# Altium schematic sheet SuperFin Baseboard pg10.SchDoc
size D; PageSetup: Record=PageOptions|CenterHorizontal=True|CenterVertical=True|PrintScale=1.06|XCorrection=1.00|YCorrection=1.00|PrintKind=0|BorderSize=5000000|LeftOffset=0|BottomOffset=0|Orientation=2|PaperLength=1000|PaperWidth=1000|Scale=100|PaperSource=15|PrintQuality=600|MediaType=1|DitherType=10|PaperKind=C|PrintScaleMode=1
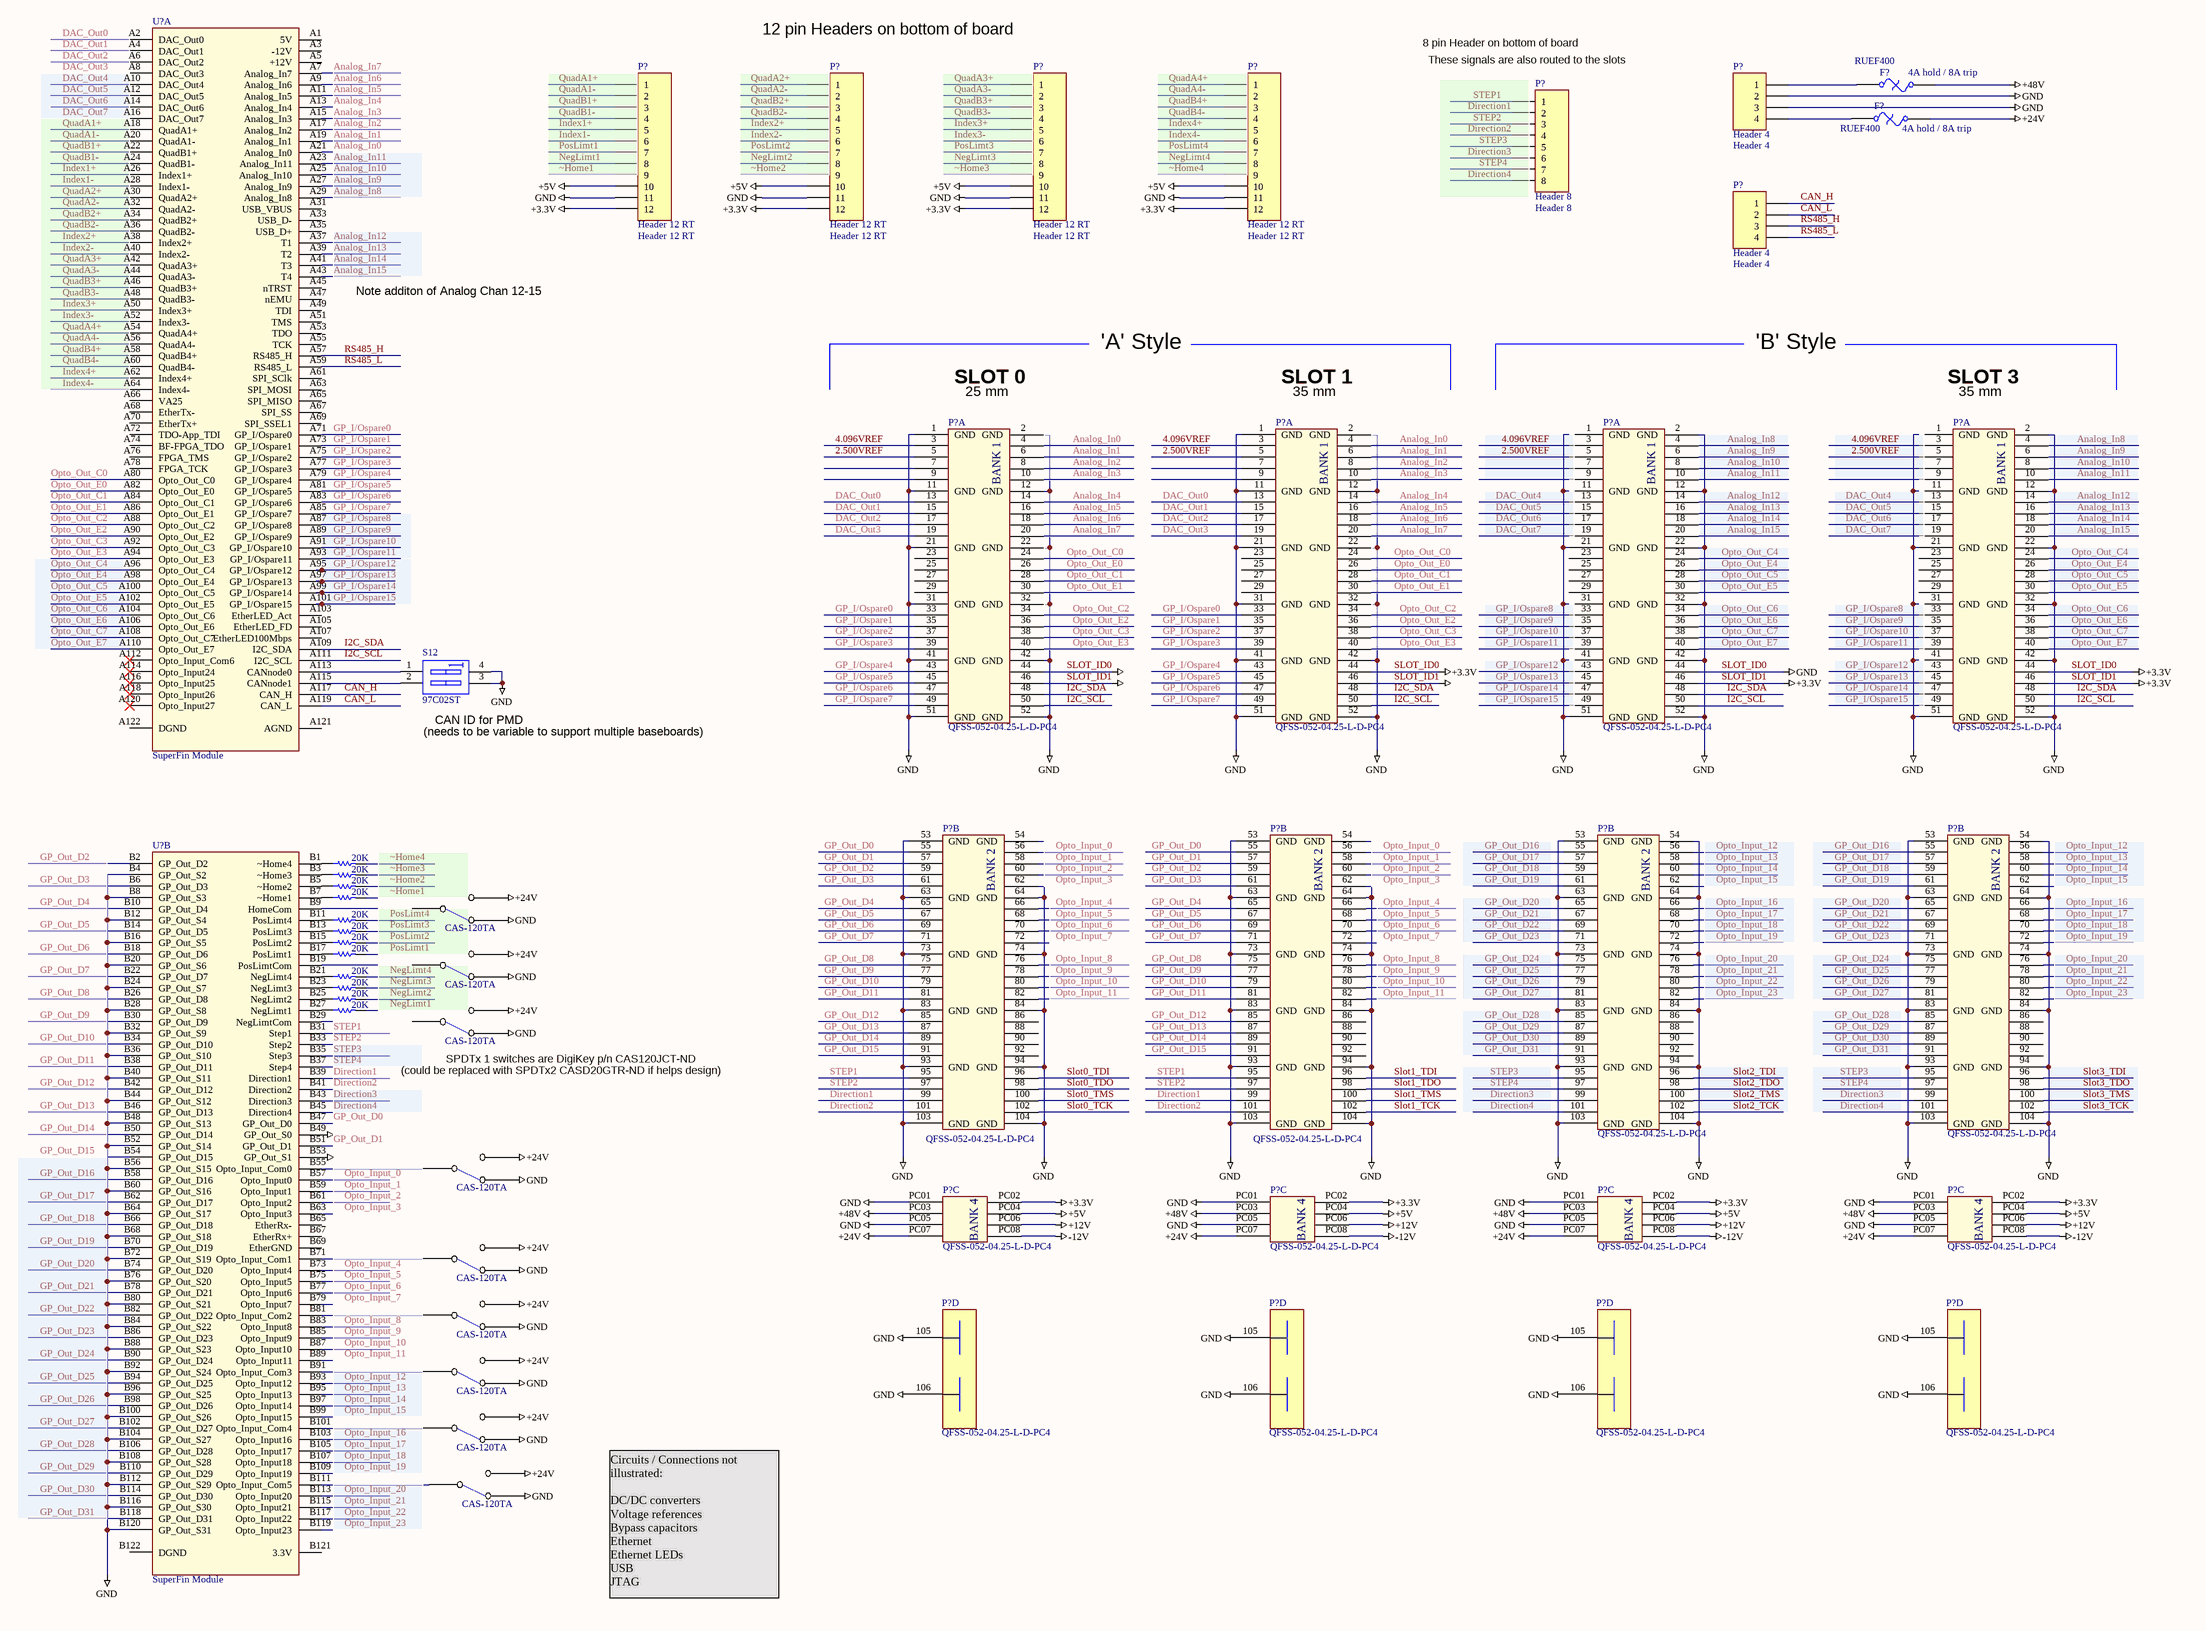
[diagram p0: SuperFin Baseboard pg10.SchDoc]

## Parts
(Parts that share a designator on the sheet are numbered #1, #2 ... from top to bottom, then left to right.)
F?#1  4A hold / 8A trip  value RUEF400  [PolySwitch Radial 0.2]
F?#2  4A hold / 8A trip  value RUEF400  [PolySwitch Radial 0.2]
P?#1  Header 12 RT  [HDR 1x12 RT for IDC]
P?#2  Header 12 RT  [HDR 1x12 RT for IDC]
P?#3  Header 12 RT  [HDR 1x12 RT for IDC]
P?#4  Header 12 RT  [HDR 1x12 RT for IDC]
P?#5  Header 4  [HDR1X4 for IDC]
P?#6  Header 8  [HDR1X8 for IDC]
P?#7  Header 4  [HDR1X4 for IDC]
P?#8  value QFSS-052-04.25-L-D-PC4  [QFS SMD PWR PINS - 104 pins]  (hidden comment: QFSS-PC4-104pin)  (part A of 4)
P?#9  value QFSS-052-04.25-L-D-PC4  [QFS SMD PWR PINS - 104 pins]  (hidden comment: QFSS-PC4-104pin)  (part A of 4)
P?#10  value QFSS-052-04.25-L-D-PC4  [QFS SMD PWR PINS - 104 pins]  (hidden comment: QFSS-PC4-104pin)  (part A of 4)
P?#11  value QFSS-052-04.25-L-D-PC4  [QFS SMD PWR PINS - 104 pins]  (hidden comment: QFSS-PC4-104pin)  (part A of 4)
P?#12  value QFSS-052-04.25-L-D-PC4  [QFS SMD PWR PINS - 104 pins]  (hidden comment: QFSS-PC4-104pin)  (part B of 4)
P?#13  value QFSS-052-04.25-L-D-PC4  [QFS SMD PWR PINS - 104 pins]  (hidden comment: QFSS-PC4-104pin)  (part B of 4)
P?#14  value QFSS-052-04.25-L-D-PC4  [QFS SMD PWR PINS - 104 pins]  (hidden comment: QFSS-PC4-104pin)  (part B of 4)
P?#15  value QFSS-052-04.25-L-D-PC4  [QFS SMD PWR PINS - 104 pins]  (hidden comment: QFSS-PC4-104pin)  (part B of 4)
P?#16  value QFSS-052-04.25-L-D-PC4  [QFS SMD PWR PINS - 104 pins]  (hidden comment: QFSS-PC4-104pin)  (part C of 4)
P?#17  value QFSS-052-04.25-L-D-PC4  [QFS SMD PWR PINS - 104 pins]  (hidden comment: QFSS-PC4-104pin)  (part C of 4)
P?#18  value QFSS-052-04.25-L-D-PC4  [QFS SMD PWR PINS - 104 pins]  (hidden comment: QFSS-PC4-104pin)  (part C of 4)
P?#19  value QFSS-052-04.25-L-D-PC4  [QFS SMD PWR PINS - 104 pins]  (hidden comment: QFSS-PC4-104pin)  (part C of 4)
P?#20  value QFSS-052-04.25-L-D-PC4  [QFS SMD PWR PINS - 104 pins]  (hidden comment: QFSS-PC4-104pin)  (part D of 4)
P?#21  value QFSS-052-04.25-L-D-PC4  [QFS SMD PWR PINS - 104 pins]  (hidden comment: QFSS-PC4-104pin)  (part D of 4)
P?#22  value QFSS-052-04.25-L-D-PC4  [QFS SMD PWR PINS - 104 pins]  (hidden comment: QFSS-PC4-104pin)  (part D of 4)
P?#23  value QFSS-052-04.25-L-D-PC4  [QFS SMD PWR PINS - 104 pins]  (hidden comment: QFSS-PC4-104pin)  (part D of 4)
R?#1  value 20K  [AXIAL-0.4]  (hidden comment: Res TH)
R?#2  value 20K  [AXIAL-0.4]  (hidden comment: Res TH)
R?#3  value 20K  [AXIAL-0.4]  (hidden comment: Res TH)
R?#4  value 20K  [AXIAL-0.4]  (hidden comment: Res TH)
R?#5  value 20K  [AXIAL-0.4]  (hidden comment: Res TH)
R?#6  value 20K  [AXIAL-0.4]  (hidden comment: Res TH)
R?#7  value 20K  [AXIAL-0.4]  (hidden comment: Res TH)
R?#8  value 20K  [AXIAL-0.4]  (hidden comment: Res TH)
R?#9  value 20K  [AXIAL-0.4]  (hidden comment: Res TH)
R?#10  value 20K  [AXIAL-0.4]  (hidden comment: Res TH)
R?#11  value 20K  [AXIAL-0.4]  (hidden comment: Res TH)
R?#12  value 20K  [AXIAL-0.4]  (hidden comment: Res TH)
S12  97C02ST  [97C02ST]
S?#1  CAS-120TA  [CAS-120B]
S?#2  CAS-120TA  [CAS-120B]
S?#3  CAS-120TA  [CAS-120B]
S?#4  CAS-120TA  [CAS-120B]
S?#5  CAS-120TA  [CAS-120B]
S?#6  CAS-120TA  [CAS-120B]
S?#7  CAS-120TA  [CAS-120B]
S?#8  CAS-120TA  [CAS-120B]
S?#9  CAS-120TA  [CAS-120B]
U?#1  SuperFin Module  [SuperFin Footprint]  (part A of 2)
U?#2  SuperFin Module  [SuperFin Footprint]  (part B of 2)

## Nets
+5V: P?#1.10 P?#2.10 P?#3.10 P?#4.10 P?#16.PC04 P?#17.PC04 P?#18.PC04 P?#19.PC04
+12V: P?#16.PC06 P?#17.PC06 P?#18.PC06 P?#19.PC06
+24V: F?#2.2 P?#16.PC07 P?#17.PC07 P?#18.PC07 P?#19.PC07 S?#1.1(NO) S?#2.1(NO) S?#3.1(NO) S?#4.1(NO) S?#5.1(NO) S?#6.1(NO) S?#7.1(NO) S?#8.1(NO) S?#9.1(NO)
+48V: F?#1.2 P?#16.PC03 P?#17.PC03 P?#18.PC03 P?#19.PC03
-12V: P?#16.PC08 P?#17.PC08 P?#18.PC08 P?#19.PC08
SLOT_ID0: P?#1.11 P?#1.12 P?#2.11 P?#2.12 P?#3.11 P?#3.12 P?#4.11 P?#4.12 P?#5.2 P?#5.3 P?#8.1(GND) P?#8.2(GND) P?#8.11(GND) P?#8.12(GND) P?#8.21(GND) P?#8.22(GND) P?#8.31(GND) P?#8.32(GND) P?#8.41(GND) P?#8.42(GND) P?#8.44 P?#8.46 P?#8.51(GND) P?#8.52(GND) P?#9.1(GND) P?#9.2(GND) P?#9.11(GND) P?#9.12(GND) P?#9.21(GND) P?#9.22(GND) P?#9.31(GND) P?#9.32(GND) P?#9.41(GND) P?#9.42(GND) P?#9.44 P?#9.46 P?#9.51(GND) P?#9.52(GND) P?#10.1(GND) P?#10.2(GND) P?#10.11(GND) P?#10.12(GND) P?#10.21(GND) P?#10.22(GND) P?#10.31(GND) P?#10.32(GND) P?#10.41(GND) P?#10.42(GND) P?#10.44 P?#10.46 P?#10.51(GND) P?#10.52(GND) P?#11.1(GND) P?#11.2(GND) P?#11.11(GND) P?#11.12(GND) P?#11.21(GND) P?#11.22(GND) P?#11.31(GND) P?#11.32(GND) P?#11.41(GND) P?#11.42(GND) P?#11.44 P?#11.46 P?#11.51(GND) P?#11.52(GND) P?#12.53(GND) P?#12.54(GND) P?#12.63(GND) P?#12.64(GND) P?#12.73(GND) P?#12.74(GND) P?#12.83(GND) P?#12.84(GND) P?#12.93(GND) P?#12.94(GND) P?#12.103(GND) P?#12.104(GND) P?#13.53(GND) P?#13.54(GND) P?#13.63(GND) P?#13.64(GND) P?#13.73(GND) P?#13.74(GND) P?#13.83(GND) P?#13.84(GND) P?#13.93(GND) P?#13.94(GND) P?#13.103(GND) P?#13.104(GND) P?#14.53(GND) P?#14.54(GND) P?#14.63(GND) P?#14.64(GND) P?#14.73(GND) P?#14.74(GND) P?#14.83(GND) P?#14.84(GND) P?#14.93(GND) P?#14.94(GND) P?#14.103(GND) P?#14.104(GND) P?#15.53(GND) P?#15.54(GND) P?#15.63(GND) P?#15.64(GND) P?#15.73(GND) P?#15.74(GND) P?#15.83(GND) P?#15.84(GND) P?#15.93(GND) P?#15.94(GND) P?#15.103(GND) P?#15.104(GND) P?#16.PC01 P?#16.PC02 P?#16.PC05 P?#17.PC01 P?#17.PC02 P?#17.PC05 P?#18.PC01 P?#18.PC02 P?#18.PC05 P?#19.PC01 P?#19.PC02 P?#19.PC05 P?#20.105(GND) P?#20.106(GND) P?#21.105(GND) P?#21.106(GND) P?#22.105(GND) P?#22.106(GND) P?#23.105(GND) P?#23.106(GND) S12.3(B2) S12.4(B1) S?#1.3(NC) S?#2.3(NC) S?#3.3(NC) S?#4.3(NC) S?#5.3(NC) S?#6.3(NC) S?#7.3(NC) S?#8.3(NC) S?#9.3(NC) U?#2.B4(GP_Out_S2) U?#2.B8(GP_Out_S3) U?#2.B12(GP_Out_S4) U?#2.B16(GP_Out_S5) U?#2.B20(GP_Out_S6) U?#2.B24(GP_Out_S7) U?#2.B28(GP_Out_S8) U?#2.B32(GP_Out_S9) U?#2.B36(GP_Out_S10) U?#2.B40(GP_Out_S11) U?#2.B44(GP_Out_S12) U?#2.B48(GP_Out_S13) U?#2.B49(GP_Out_S0) U?#2.B52(GP_Out_S14) U?#2.B53(GP_Out_S1) U?#2.B56(GP_Out_S15) U?#2.B60(GP_Out_S16) U?#2.B64(GP_Out_S17) U?#2.B68(GP_Out_S18) U?#2.B72(GP_Out_S19) U?#2.B76(GP_Out_S20) U?#2.B80(GP_Out_S21) U?#2.B84(GP_Out_S22) U?#2.B88(GP_Out_S23) U?#2.B92(GP_Out_S24) U?#2.B96(GP_Out_S25) U?#2.B100(GP_Out_S26) U?#2.B104(GP_Out_S27) U?#2.B108(GP_Out_S28) U?#2.B112(GP_Out_S29) U?#2.B116(GP_Out_S30) U?#2.B120(GP_Out_S31)  [also labelled +3.3V, GND, SLOT_ID1]
2.500VREF: P?#8.5 P?#9.5 P?#10.5 P?#11.5
4.096VREF: P?#8.3 P?#9.3 P?#10.3 P?#11.3
Analog_In0: P?#8.4 P?#9.4 U?#1.A21(Analog_In0)
Analog_In1: P?#8.6 P?#9.6 U?#1.A19(Analog_In1)
Analog_In2: P?#8.8 P?#9.8 U?#1.A17(Analog_In2)
Analog_In3: P?#8.10 P?#9.10 U?#1.A15(Analog_In3)
Analog_In4: P?#8.14 P?#9.14 U?#1.A13(Analog_In4)
Analog_In5: P?#8.16 P?#9.16 U?#1.A11(Analog_In5)
Analog_In6: P?#8.18 P?#9.18 U?#1.A9(Analog_In6)
Analog_In7: P?#8.20 P?#9.20 U?#1.A7(Analog_In7)
Analog_In8: P?#10.4 P?#11.4 U?#1.A29(Analog_In8)
Analog_In9: P?#10.6 P?#11.6 U?#1.A27(Analog_In9)
Analog_In10: P?#10.8 P?#11.8 U?#1.A25(Analog_In10)
Analog_In11: P?#10.10 P?#11.10 U?#1.A23(Analog_In11)
Analog_In12: P?#10.14 P?#11.14 U?#1.A37(T1)
Analog_In13: P?#10.16 P?#11.16 U?#1.A39(T2)
Analog_In14: P?#10.18 P?#11.18 U?#1.A41(T3)
Analog_In15: P?#10.20 P?#11.20 U?#1.A43(T4)
CAN_H: P?#7.1 U?#1.A117(CAN_H)
CAN_L: P?#7.2 U?#1.A119(CAN_L)
DAC_Out0: P?#8.13 P?#9.13 U?#1.A2(DAC_Out0)
DAC_Out1: P?#8.15 P?#9.15 U?#1.A4(DAC_Out1)
DAC_Out2: P?#8.17 P?#9.17 U?#1.A6(DAC_Out2)
DAC_Out3: P?#8.19 P?#9.19 U?#1.A8(DAC_Out3)
DAC_Out4: P?#10.13 P?#11.13 U?#1.A10(DAC_Out4)
DAC_Out5: P?#10.15 P?#11.15 U?#1.A12(DAC_Out5)
DAC_Out6: P?#10.17 P?#11.17 U?#1.A14(DAC_Out6)
DAC_Out7: P?#10.19 P?#11.19 U?#1.A16(DAC_Out7)
Direction1: P?#6.2 P?#12.99 P?#13.99 U?#2.B39(Direction1)
Direction2: P?#6.4 P?#12.101 P?#13.101 U?#2.B41(Direction2)
Direction3: P?#6.6 P?#14.99 P?#15.99 U?#2.B43(Direction3)
Direction4: P?#6.8 P?#14.101 P?#15.101 U?#2.B45(Direction4)
GP_I/Ospare0: P?#8.33 P?#9.33 U?#1.A71(GP_I/Ospare0)
GP_I/Ospare1: P?#8.35 P?#9.35 U?#1.A73(GP_I/Ospare1)
GP_I/Ospare2: P?#8.37 P?#9.37 U?#1.A75(GP_I/Ospare2)
GP_I/Ospare3: P?#8.39 P?#9.39 U?#1.A77(GP_I/Ospare3)
GP_I/Ospare4: P?#8.43 P?#9.43 U?#1.A79(GP_I/Ospare4)
GP_I/Ospare5: P?#8.45 P?#9.45 U?#1.A81(GP_I/Ospare5)
GP_I/Ospare6: P?#8.47 P?#9.47 U?#1.A83(GP_I/Ospare6)
GP_I/Ospare7: P?#8.49 P?#9.49 U?#1.A85(GP_I/Ospare7)
GP_I/Ospare8: P?#10.33 P?#11.33 U?#1.A87(GP_I/Ospare8)
GP_I/Ospare9: P?#10.35 P?#11.35 U?#1.A89(GP_I/Ospare9)
GP_I/Ospare10: P?#10.37 P?#11.37 U?#1.A91(GP_I/Ospare10)
GP_I/Ospare11: P?#10.39 P?#11.39 U?#1.A93(GP_I/Ospare11)
GP_I/Ospare12: P?#10.43 P?#11.43 U?#1.A95(GP_I/Ospare12)
GP_I/Ospare13: P?#10.45 P?#11.45 U?#1.A97(GP_I/Ospare13)
GP_I/Ospare14: P?#10.47 P?#11.47 U?#1.A99(GP_I/Ospare14)
GP_I/Ospare15: P?#10.49 P?#11.49 U?#1.A101(GP_I/Ospare15)
GP_Out_D0: P?#12.55 P?#13.55 U?#2.B47(GP_Out_D0)
GP_Out_D1: P?#12.57 P?#13.57 U?#2.B51(GP_Out_D1)
GP_Out_D2: P?#12.59 P?#13.59 U?#2.B2(GP_Out_D2)
GP_Out_D3: P?#12.61 P?#13.61 U?#2.B6(GP_Out_D3)
GP_Out_D4: P?#12.65 P?#13.65 U?#2.B10(GP_Out_D4)
GP_Out_D5: P?#12.67 P?#13.67 U?#2.B14(GP_Out_D5)
GP_Out_D6: P?#12.69 P?#13.69 U?#2.B18(GP_Out_D6)
GP_Out_D7: P?#12.71 P?#13.71 U?#2.B22(GP_Out_D7)
GP_Out_D8: P?#12.75 P?#13.75 U?#2.B26(GP_Out_D8)
GP_Out_D9: P?#12.77 P?#13.77 U?#2.B30(GP_Out_D9)
GP_Out_D10: P?#12.79 P?#13.79 U?#2.B34(GP_Out_D10)
GP_Out_D11: P?#12.81 P?#13.81 U?#2.B38(GP_Out_D11)
GP_Out_D12: P?#12.85 P?#13.85 U?#2.B42(GP_Out_D12)
GP_Out_D13: P?#12.87 P?#13.87 U?#2.B46(GP_Out_D13)
GP_Out_D14: P?#12.89 P?#13.89 U?#2.B50(GP_Out_D14)
GP_Out_D15: P?#12.91 P?#13.91 U?#2.B54(GP_Out_D15)
GP_Out_D16: P?#14.55 P?#15.55 U?#2.B58(GP_Out_D16)
GP_Out_D17: P?#14.57 P?#15.57 U?#2.B62(GP_Out_D17)
GP_Out_D18: P?#14.59 P?#15.59 U?#2.B66(GP_Out_D18)
GP_Out_D19: P?#14.61 P?#15.61 U?#2.B70(GP_Out_D19)
GP_Out_D20: P?#14.65 P?#15.65 U?#2.B74(GP_Out_D20)
GP_Out_D21: P?#14.67 P?#15.67 U?#2.B78(GP_Out_D21)
GP_Out_D22: P?#14.69 P?#15.69 U?#2.B82(GP_Out_D22)
GP_Out_D23: P?#14.71 P?#15.71 U?#2.B86(GP_Out_D23)
GP_Out_D24: P?#14.75 P?#15.75 U?#2.B90(GP_Out_D24)
GP_Out_D25: P?#14.77 P?#15.77 U?#2.B94(GP_Out_D25)
GP_Out_D26: P?#14.79 P?#15.79 U?#2.B98(GP_Out_D26)
GP_Out_D27: P?#14.81 P?#15.81 U?#2.B102(GP_Out_D27)
GP_Out_D28: P?#14.85 P?#15.85 U?#2.B106(GP_Out_D28)
GP_Out_D29: P?#14.87 P?#15.87 U?#2.B110(GP_Out_D29)
GP_Out_D30: P?#14.89 P?#15.89 U?#2.B114(GP_Out_D30)
GP_Out_D31: P?#14.91 P?#15.91 U?#2.B118(GP_Out_D31)
I2C_SCL: P?#8.50 P?#9.50 P?#10.50 P?#11.50 U?#1.A111(I2C_SCL)
I2C_SDA: P?#8.48 P?#9.48 P?#10.48 P?#11.48 U?#1.A109(I2C_SDA)
Index1+: P?#1.5 U?#1.A26(Index1+)
Index1-: P?#1.6 U?#1.A28(Index1-)
Index2+: P?#2.5 U?#1.A38(Index2+)
Index2-: P?#2.6 U?#1.A40(Index2-)
Index3+: P?#3.5 U?#1.A50(Index3+)
Index3-: P?#3.6 U?#1.A52(Index3-)
Index4+: P?#4.5 U?#1.A62(Index4+)
Index4-: P?#4.6 U?#1.A64(Index4-)
NegLimt1: P?#1.8 R?#12.2
NegLimt2: P?#2.8 R?#11.2
NegLimt3: P?#3.8 R?#10.2
NegLimt4: P?#4.8 R?#9.2
Opto_Input_0: P?#12.56 P?#13.56 U?#2.B57(Opto_Input0)
Opto_Input_1: P?#12.58 P?#13.58 U?#2.B59(Opto_Input1)
Opto_Input_2: P?#12.60 P?#13.60 U?#2.B61(Opto_Input2)
Opto_Input_3: P?#12.62 P?#13.62 U?#2.B63(Opto_Input3)
Opto_Input_4: P?#12.66 P?#13.66 U?#2.B73(Opto_Input4)
Opto_Input_5: P?#12.68 P?#13.68 U?#2.B75(Opto_Input5)
Opto_Input_6: P?#12.70 P?#13.70 U?#2.B77(Opto_Input6)
Opto_Input_7: P?#12.72 P?#13.72 U?#2.B79(Opto_Input7)
Opto_Input_8: P?#12.76 P?#13.76 U?#2.B83(Opto_Input8)
Opto_Input_9: P?#12.78 P?#13.78 U?#2.B85(Opto_Input9)
Opto_Input_10: P?#12.80 P?#13.80 U?#2.B87(Opto_Input10)
Opto_Input_11: P?#12.82 P?#13.82 U?#2.B89(Opto_Input11)
Opto_Input_12: P?#14.56 P?#15.56 U?#2.B93(Opto_Input12)
Opto_Input_13: P?#14.58 P?#15.58 U?#2.B95(Opto_Input13)
Opto_Input_14: P?#14.60 P?#15.60 U?#2.B97(Opto_Input14)
Opto_Input_15: P?#14.62 P?#15.62 U?#2.B99(Opto_Input15)
Opto_Input_16: P?#14.66 P?#15.66 U?#2.B103(Opto_Input16)
Opto_Input_17: P?#14.68 P?#15.68 U?#2.B105(Opto_Input17)
Opto_Input_18: P?#14.70 P?#15.70 U?#2.B107(Opto_Input18)
Opto_Input_19: P?#14.72 P?#15.72 U?#2.B109(Opto_Input19)
Opto_Input_20: P?#14.76 P?#15.76 U?#2.B113(Opto_Input20)
Opto_Input_21: P?#14.78 P?#15.78 U?#2.B115(Opto_Input21)
Opto_Input_22: P?#14.80 P?#15.80 U?#2.B117(Opto_Input22)
Opto_Input_23: P?#14.82 P?#15.82 U?#2.B119(Opto_Input23)
Opto_Out_C0: P?#8.24 P?#9.24 U?#1.A80(Opto_Out_C0)
Opto_Out_C1: P?#8.28 P?#9.28 U?#1.A84(Opto_Out_C1)
Opto_Out_C2: P?#8.34 P?#9.34 U?#1.A88(Opto_Out_C2)
Opto_Out_C3: P?#8.38 P?#9.38 U?#1.A92(Opto_Out_C3)
Opto_Out_C4: P?#10.24 P?#11.24 U?#1.A96(Opto_Out_C4)
Opto_Out_C5: P?#10.28 P?#11.28 U?#1.A100(Opto_Out_C5)
Opto_Out_C6: P?#10.34 P?#11.34 U?#1.A104(Opto_Out_C6)
Opto_Out_C7: P?#10.38 P?#11.38 U?#1.A108(Opto_Out_C7)
Opto_Out_E0: P?#8.26 P?#9.26 U?#1.A82(Opto_Out_E0)
Opto_Out_E1: P?#8.30 P?#9.30 U?#1.A86(Opto_Out_E1)
Opto_Out_E2: P?#8.36 P?#9.36 U?#1.A90(Opto_Out_E2)
Opto_Out_E3: P?#8.40 P?#9.40 U?#1.A94(Opto_Out_E3)
Opto_Out_E4: P?#10.26 P?#11.26 U?#1.A98(Opto_Out_E4)
Opto_Out_E5: P?#10.30 P?#11.30 U?#1.A102(Opto_Out_E5)
Opto_Out_E6: P?#10.36 P?#11.36 U?#1.A106(Opto_Out_E6)
Opto_Out_E7: P?#10.40 P?#11.40 U?#1.A110(Opto_Out_E7)
PosLimt1: P?#1.7 R?#8.2
PosLimt2: P?#2.7 R?#7.2
PosLimt3: P?#3.7 R?#6.2
PosLimt4: P?#4.7 R?#5.2
QuadA1+: P?#1.1 U?#1.A18(QuadA1+)
QuadA1-: P?#1.2 U?#1.A20(QuadA1-)
QuadA2+: P?#2.1 U?#1.A30(QuadA2+)
QuadA2-: P?#2.2 U?#1.A32(QuadA2-)
QuadA3+: P?#3.1 U?#1.A42(QuadA3+)
QuadA3-: P?#3.2 U?#1.A44(QuadA3-)
QuadA4+: P?#4.1 U?#1.A54(QuadA4+)
QuadA4-: P?#4.2 U?#1.A56(QuadA4-)
QuadB1+: P?#1.3 U?#1.A22(QuadB1+)
QuadB1-: P?#1.4 U?#1.A24(QuadB1-)
QuadB2+: P?#2.3 U?#1.A34(QuadB2+)
QuadB2-: P?#2.4 U?#1.A36(QuadB2-)
QuadB3+: P?#3.3 U?#1.A46(QuadB3+)
QuadB3-: P?#3.4 U?#1.A48(QuadB3-)
QuadB4+: P?#4.3 U?#1.A58(QuadB4+)
QuadB4-: P?#4.4 U?#1.A60(QuadB4-)
RS485_H: P?#7.3 U?#1.A57(RS485_H)
RS485_L: P?#7.4 U?#1.A59(RS485_L)
Slot0_TCK: P?#12.102
Slot0_TDI: P?#12.96
Slot0_TDO: P?#12.98
Slot0_TMS: P?#12.100
Slot1_TCK: P?#13.102
Slot1_TDI: P?#13.96
Slot1_TDO: P?#13.98
Slot1_TMS: P?#13.100
Slot2_TCK: P?#14.102
Slot2_TDI: P?#14.96
Slot2_TDO: P?#14.98
Slot2_TMS: P?#14.100
Slot3_TCK: P?#15.102
Slot3_TDI: P?#15.96
Slot3_TDO: P?#15.98
Slot3_TMS: P?#15.100
STEP1: P?#6.1 P?#12.95 P?#13.95 U?#2.B31(Step1)
STEP2: P?#6.3 P?#12.97 P?#13.97 U?#2.B33(Step2)
STEP3: P?#6.5 P?#14.95 P?#15.95 U?#2.B35(Step3)
STEP4: P?#6.7 P?#14.97 P?#15.97 U?#2.B37(Step4)
~Home1: P?#1.9 R?#4.2
~Home2: P?#2.9 R?#3.2
~Home3: P?#3.9 R?#2.2
~Home4: P?#4.9 R?#1.2
NetF?#1_1: F?#1.1 P?#5.1
NetF?#2_1: F?#2.1 P?#5.4
NetR?#1_1: R?#1.1 U?#2.B1(~Home4)
NetR?#2_1: R?#2.1 U?#2.B3(~Home3)
NetR?#3_1: R?#3.1 U?#2.B5(~Home2)
NetR?#4_1: R?#4.1 U?#2.B7(~Home1)
NetR?#5_1: R?#5.1 U?#2.B11(PosLimt4)
NetR?#6_1: R?#6.1 U?#2.B13(PosLimt3)
NetR?#7_1: R?#7.1 U?#2.B15(PosLimt2)
NetR?#8_1: R?#8.1 U?#2.B17(PosLimt1)
NetR?#9_1: R?#9.1 U?#2.B21(NegLimt4)
NetR?#10_1: R?#10.1 U?#2.B23(NegLimt3)
NetR?#11_1: R?#11.1 U?#2.B25(NegLimt2)
NetR?#12_1: R?#12.1 U?#2.B27(NegLimt1)
NetS12_1: S12.1(A1) U?#1.A113(CANnode0)
NetS12_2: S12.2(A2) U?#1.A115(CANnode1)
NetS?#1_2: S?#1.2(COM) U?#2.B9(HomeCom)
NetS?#2_2: S?#2.2(COM) U?#2.B19(PosLimtCom)
NetS?#3_2: S?#3.2(COM) U?#2.B29(NegLimtCom)
NetS?#4_2: S?#4.2(COM) U?#2.B55(Opto_Input_Com0)
NetS?#5_2: S?#5.2(COM) U?#2.B71(Opto_Input_Com1)
NetS?#6_2: S?#6.2(COM) U?#2.B81(Opto_Input_Com2)
NetS?#7_2: S?#7.2(COM) U?#2.B91(Opto_Input_Com3)
NetS?#8_2: S?#8.2(COM) U?#2.B101(Opto_Input_Com4)
NetS?#9_2: S?#9.2(COM) U?#2.B111(Opto_Input_Com5)

Not connected (* = marked no-connect by the designer): P?#8 7 9 23 25 27 29; P?#9 7 9 23 25 27 29; P?#10 7 9 23 25 27 29; P?#11 7 9 23 25 27 29; P?#12 86 88 90 92; P?#13 86 88 90 92; P?#14 86 88 90 92; P?#15 86 88 90 92; U?#1 A1(5V) A3(-12V) A5(+12V) A31(USB_VBUS) A33(USB_D-) A35(USB_D+) A45(nTRST) A47(nEMU) A49(TDI) A51(TMS) A53(TDO) A55(TCK) A61(SPI_SClk) A63(SPI_MOSI) A65(SPI_MISO) A66(VA25) A67(SPI_SS) A68(EtherTx-) A69(SPI_SSEL1) A70(EtherTx+) A72(TDO-App_TDI) A74(BF-FPGA_TDO) A76(FPGA_TMS) A78(FPGA_TCK) A103(EtherLED_Act) A105(EtherLED_FD) A107(EtherLED100Mbps) A112(Opto_Input_Com6)* A114(Opto_Input24)* A116(Opto_Input25)* A118(Opto_Input26)* A120(Opto_Input27)* A121(AGND) A122(DGND); U?#2 B65(EtherRx-) B67(EtherRx+) B69(EtherGND) B121(3.3V) B122(DGND)

## Notes on the sheet
- 12 pin Headers on bottom of board
- 8 pin Header on bottom of board
- (near P?#6) These signals are also routed to the slots
- Note additon of Analog Chan 12-15
- SLOT 0
- 'A' Style
- SLOT 1
- 'B' Style
- SLOT 3
- (near P?#8) 25 mm
- (near P?#9) 35 mm
- (near P?#11) 35 mm
- (near S12) CAN ID for PMD
- (near S12) (needs to be variable to support multiple baseboards)
- (near S?#3) SPDTx 1 switches are DigiKey p/n CAS120JCT-ND
- (near S?#3) (could be replaced with SPDTx2 CASD20GTR-ND if helps design)
- Circuits / Connections not illustrated:
  DC/DC converters
  Voltage references
  Bypass capacitors
  Ethernet
  Ethernet LEDs
  USB
  JTAG
- (in symbol QFSS-PC4-104pin, part A) BANK 1
- (in symbol QFSS-PC4-104pin, part B) BANK 2
- (in symbol QFSS-PC4-104pin, part C) BANK 4

## Library data of the parts
F?#1 F?#2 = Fuse Thermal: PolySwitch RUE Series
P?#1-P?#4 = Header 12 RT: Header, 12-Pin Right Angle; VALUE: Header 12 RT
P?#5 P?#7 = Header 4: Header, 4-Pin; LCO p/n: 125-00037; VALUE: Header 4
P?#6 = Header 8: Header, 8-Pin; VALUE: Header 8
P?#8-P?#23 = QFSS-PC4-104pin: SAMTEC QFSS W/PWR PINS; Vendor Mult.: 1; Manufacturer: SAMTEC; Manuf p/n: QFSS-052-04.25-L-D-PC4; Vendor: SAMTEC; Vendor p/n: QFSS-052-04.25-L-D-PC4; COST: 17.42
R?#1-R?#12 = Res TH: Resistor
S12 = SW DIP-2: DIP Switch, 2 Position, SPST; Manufacturer: Grayhill; Vendor: DIGIKEY; Vendor Mult.: 1; Vendor p/n: GH1370-ND; LCO p/n: 185-00008; COST: 1.97; Manuf p/n: 97C02ST; Value: SW DIP-2
S?#1-S?#9 = SW_SPDT_DOUG: Manufacturer: Copal Electronics; Vendor: DIGIKEY; Vendor Mult.: 1; Vendor p/n: CAS120JTR-ND; LCO p/n: 185-00010; COST: 1.27; Manuf p/n: CAS-120TA; Value: SW_SPDT
U?#1 U?#2 = SuperFin Module: LCO p/n: 830-00010